# Altium schematic sheet Barometers.SchDoc
size A4; SheetNumber: 8; SheetTotal: 8
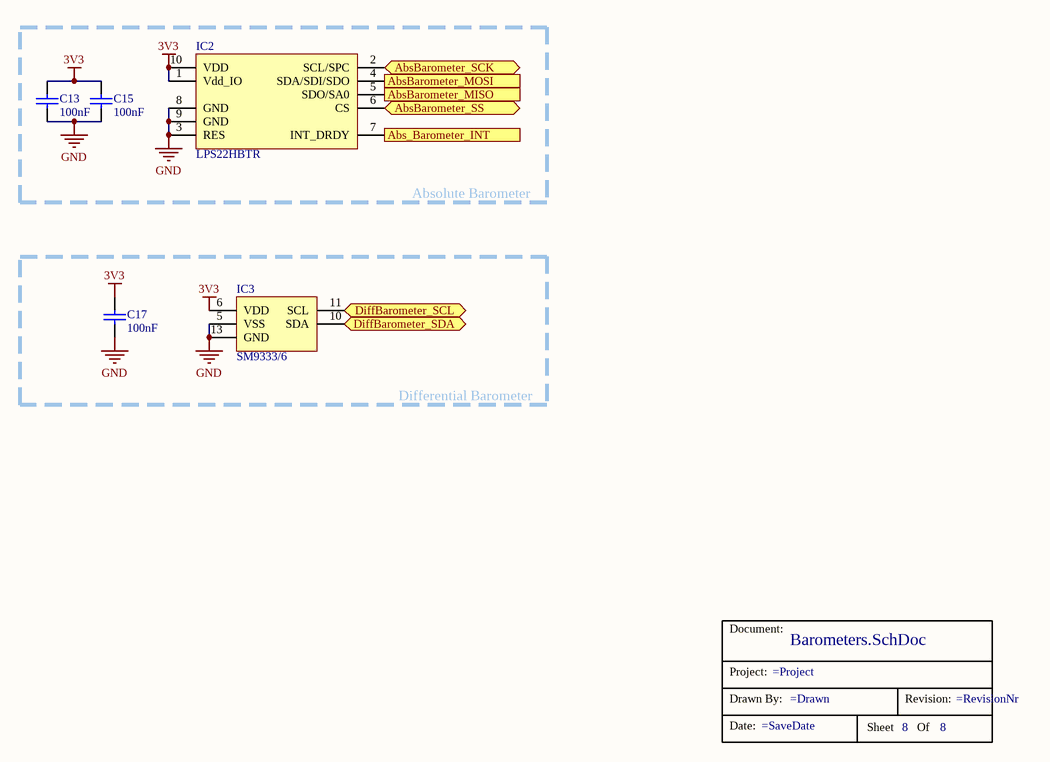
[diagram p0: Barometers.SchDoc]

## Parts
*  TitleBox  (value not drawn)
C13  Capacitance: 100nF  [C0603 N]
C15  Capacitance: 100nF  [C0603 N]
C17  Capacitance: 100nF  [C0603 N]
IC2  LPS22HBTR  [HLGA-10L, Least]
IC3  SM9333/6  [SOIC16, LEAST]

## Blocks framed on the sheet
Absolute Barometer: C13 C15 IC2
Differential Barometer: C17 IC3

## Ports
Abs_Barometer_INT (out), AbsBarometer_MISO (out), AbsBarometer_MOSI (in), AbsBarometer_SCK (bidir), AbsBarometer_SS (bidir), DiffBarometer_SCL (bidir), DiffBarometer_SDA (bidir)

## Nets
3V3: C13.2 C15.2 C17.2 IC2.1(Vdd_IO) IC2.10(VDD) IC3.6(VDD)
GND: C13.1 C15.1 C17.1 IC2.3(RES) IC2.8(GND) IC2.9(GND) IC3.5(VSS) IC3.13(GND)
Abs_Barometer_INT: IC2.7(INT_DRDY) ; port Abs_Barometer_INT
AbsBarometer_MISO: IC2.5(SDO/SA0) ; port AbsBarometer_MISO
AbsBarometer_MOSI: IC2.4(SDA/SDI/SDO) ; port AbsBarometer_MOSI
AbsBarometer_SCK: IC2.2(SCL/SPC) ; port AbsBarometer_SCK
AbsBarometer_SS: IC2.6(CS) ; port AbsBarometer_SS
DiffBarometer_SCL: IC3.11(SCL) ; port DiffBarometer_SCL
DiffBarometer_SDA: IC3.10(SDA) ; port DiffBarometer_SDA

## Notes on the sheet
- (in symbol TitleBox) Document:; Project:; Drawn By:; Revision:; Date:; Sheet; Of

## Library data of the parts
C13 C15 C17 = Capacitor: Ceramic capacitor; Type: MLCC; Voltage rating: *V; Characteristic: *; Manufacturer: *; Note: C0603 N
IC2 = LPS22HBTR: Pressure Sensor, 260-1260 hPa, 1Hz...75Hz, 1.7...3.6Vin, 12uA, 24-bit, LPS22HBTR, HLGA-10L, STMicroelectronics; ComponentLink1Description: Datasheet; ComponentLink1URL: https://www.st.com/resource/en/datasheet/lps22hb.pdf; Supplier 1: Farnell; Supplier Part Number 1: 2532382
IC3 = SM9333/6: Differentsial sensor, 125 or 250 Pa, 2000Hz, 3.0-5.5Vin; ComponentLink1Description: Datasheet; ComponentLink1URL: https://www.mouser.com/datasheet/2/589/Datasheet_SM9333_SM9336-1317493.pdf